# EAGLE design Buck_Regulator_AP3429A_1V8 (EAGLE 9.6.2)
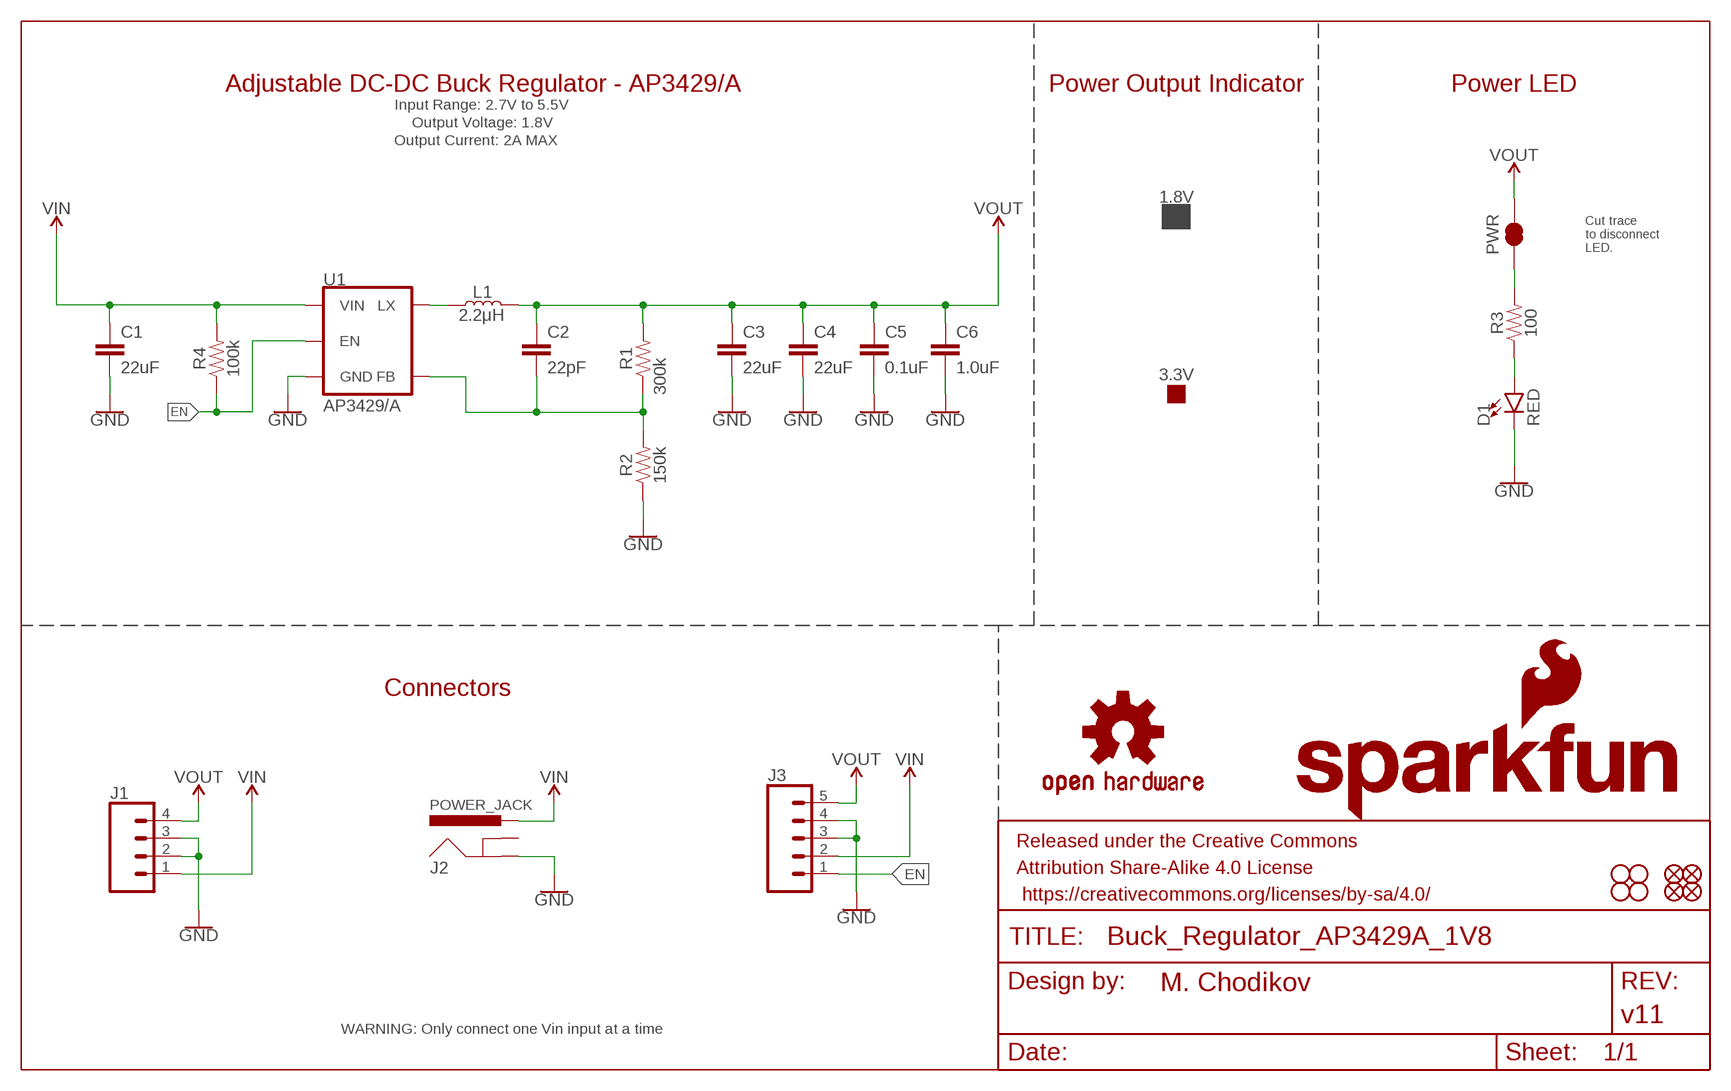
[diagram p0: schematic, sheet 1]

## Parts
1.8V  PROD_ID_PASTE_NO-SILK  [PRODUCT_IDENT_PASTE_NO-SILK]
3.3V  PROD_ID_NO-PASTE_NO_SILK  [PRODUCT_IDENT_NO_NO-SILK]
C1  22uF  22UF-0805-16V-20%  [0805]
C2  22pF  22PF-0402T-16V-10%  [0402-TIGHT]
C3  22uF  22UF-0805-16V-20%  [0805]
C4  22uF  22UF-0805-16V-20%  [0805]
C5  0.1uF  0.1UF-0603-25V-5%  [0603]
C6  1.0uF  1.0UF-0603-16V-10%-X7R  [0603]
D1  RED  LED-RED0603  [LED-0603]
FD1  FIDUCIALUFIDUCIAL  [FIDUCIAL-MICRO]
FD2  FIDUCIALUFIDUCIAL  [FIDUCIAL-MICRO]
FD3  FIDUCIALUFIDUCIAL  [FIDUCIAL-MICRO]
FD4  FIDUCIALUFIDUCIAL  [FIDUCIAL-MICRO]
FRAME1  FRAME-LEDGER  [CREATIVE_COMMONS]
H1  STAND-OFFTIGHT  [STAND-OFF-TIGHT]
H2  STAND-OFFTIGHT  [STAND-OFF-TIGHT]
H3  STAND-OFFTIGHT  [STAND-OFF-TIGHT]
H4  STAND-OFFTIGHT  [STAND-OFF-TIGHT]
J1  Screw Terminal  CONN_04SCREW  [SCREWTERMINAL-3.5MM-4]
J2  POWER_JACKPOWER_JACK_SLOT_COMBO  [POWER_JACK_PTH_SLOT_BOTH]
J3  Breakout Headers  CONN_05NO_SILK  [1X05_NO_SILK]
L1  2.2μH  2.2μH-4X4-2.2μH-3A-45MOHM  [INDUCTOR_4X4MM]
LOGO1  OSHW-LOGOS  [OSHW-LOGO-S]
LOGO2  SFE_LOGO_NAME.1_INCH  [SFE_LOGO_NAME_.1]
LOGO3  SFE_LOGO_FLAME.1_INCH  [SFE_LOGO_FLAME_.1]
PWR  JUMPER-SMT_2_NC_TRACE_SILK  [SMT-JUMPER_2_NC_TRACE_SILK]
R1  300k  300KOHM-0603-1/10W-1%  [0603]
R2  150k  150KOHM-0603-1/10W-1%  [0603]
R3  100  100OHM-0603-1/10W-1%  [0603]
R4  100k  100KOHM-0603-1/10W-1%  [0603]
U1  AP3429/A  [SOT23-5]

## Nets
EN: J3.1 R4.1 U1.1(EN)
GND: C1.2 C3.2 C4.2 C5.2 C6.2 D1.C J1.2 J1.3 J2.GND J3.3 J3.4 R2.1 U1.2(GND)
N$1: L1.P$1 U1.3(LX)
N$2: C2.2 R1.1 R2.2 U1.5(FB)
N$3: PWR.1 R3.2
N$4: D1.A R3.1
VIN: C1.1 J1.1 J2.PWR J3.2 R4.2 U1.4(VIN)
VOUT: C2.1 C3.1 C4.1 C5.1 C6.1 J1.4 J3.5 L1.P$2 PWR.2 R1.2
Unconnected: J2.GNDBREAK J2.GNDBREAK1(GNDBREAK)

## Notes on the sheet
- Adjustable DC-DC Buck Regulator - AP3429/A | Power Output Indicator | Power LED
- Input Range: 2.7V to 5.5V
- Output Voltage: 1.8V
- Output Current: 2A MAX
- Cut trace
  to disconnect
  LED.
- Connectors
- POWER_JACK
- WARNING: Only connect one Vin input at a time

## Library data of the parts
1.8V = SparkFun-Aesthetics:PROD_ID_PASTE
3.3V = SparkFun-Aesthetics:PROD_ID_NO-PASTE
C1 C3 C4 = SparkFun-Capacitors:22UF: 22µF ceramic capacitors A capacitor is a passive two-terminal electrical component used to store electrical energy temporarily in an electric field.; PROD_ID: CAP-14260
C2 = SparkFun-Capacitors:22PF: 22pF ceramic capacitors A capacitor is a passive two-terminal electrical component used to store electrical energy temporarily in an electric field.; PROD_ID: CAP-14674
C5 = SparkFun-Capacitors:0.1UF: 0.1µF ceramic capacitors A capacitor is a passive two-terminal electrical component used to store electrical energy temporarily in an electric field.; PROD_ID: CAP-08604
C6 = SparkFun-Capacitors:1.0UF: 1µF ceramic capacitors A capacitor is a passive two-terminal electrical component used to store electrical energy temporarily in an electric field.; PROD_ID: CAP-13930
D1 = SparkFun-LED:LED-RED: Red SMD LED Used in manufacturing of most products at SparkFun Packages: 0603 - SMD 0603 package [Product Link] <http://docs.avagotech.com/docs/AV02-0551EN> 0603 SMART - SMD 0603 SMART package ( more efficient and expensive)[Product Link] <http://www.osram-os.com/Graphics/XPic2/00077099_0.pdf> 1206 - SMD1206 package [Product Link] <https://www.sparkfun.com/datasheets/DevTools/LilyPad/Q150OVS4.pdff> SparkFun Products: Pro Mini 328 -5V <https://www.sparkfun.com/products/821> RedBoard <https://www.sparkfun.com/products/12757> IOIO-OTG <https://www.sparkfun.com/products/13613>; PROD_ID: DIO-00819
FD1-FD4 = SparkFun-Aesthetics:FIDUCIAL: Fiducial Alignment Points Point-of-reference for pick-and-place machines and other optical instruments.
FRAME1 = SparkFun-Aesthetics:FRAME-LEDGER: Schematic Frame - Ledger Standard 11x14 US Ledger frame; DESIGNER: M. Chodikov; REV: v11
H1-H4 = SparkFun-Hardware:STAND-OFF: Stand Off Drill holes for mechanically mounting via screws, standoffs, etc. Note: Use the keepout ring to avoid running the screw head into surrounding components. Variant Overviews STAND-OFF - Mechanical footprint for a #4 phillips button head screw. STAND-OFF-TIGHT - Mechanical footprint for a #4 phillips button head screw, Example SparkFun Products Screw - Phillips Head (1/4", 4-40, 10 pack) <https://www.sparkfun.com/products/10453> (PRT-10453) Screw - Phillips Head (1/2", 4-40, 10 pack) <https://www.sparkfun.com/products/10452> (PRT-10452) Screw - Phillips Head (3/4", 4-40, 10 pack) <https://www.sparkfun.com/products/10451> (PRT-10451) Screw - Phillips Head (1", 4-40, 10 pack) <https://www.sparkfun.com/products/10450> (PRT-10450)
J1 = SparkFun-Connectors:CONN_04: Multi connection point. Often used as Generic Header-pin footprint for 0.1 inch spaced/style header connections On any of the 0.1 inch spaced packages, you can populate with these: Break Away Headers - Straight <https://www.sparkfun.com/products/116> (PRT-00116) Break Away Male Headers - Right Angle <https://www.sparkfun.com/products/553> (PRT-00553) Female Headers <https://www.sparkfun.com/products/115> (PRT-00115) Break Away Headers - Machine Pin <https://www.sparkfun.com/products/117> (PRT-00117) Break Away Female Headers - Swiss Machine Pin <https://www.sparkfun.com/products/743> (PRT-00743) For SCREWTERMINALS and SPRING TERMINALS visit here: Screw Terimnals on SparkFun.com <https://www.sparkfun.com/search/results?term=Screw+Terminals> (5mm/3.5mm/2.54mm spacing) This device is also useful as a general connection point to wire up your design to another part of your project. Our various solder wires solder well into these plated through hole pads. Hook-Up Wire - Assortment (Stranded, 22 AWG) <https://www.sparkfun.com/products/11375> (PRT-11375) Hook-Up Wire - Assortment (Solid Core, 22 AWG) <https://www.sparkfun.com/products/11367> (PRT-11367) View the entire wire category on our website here <https://www.sparkfun.com/categories/141> Special notes: Molex polarized connector foot print use with SKU : PRT-08231 with associated crimp pins and housings. 1MM SMD Version SKU: PRT-10208; PROD_ID: CONN-14485
J2 = SparkFun-Connectors:POWER_JACK: Power Jack Connector This is the standard 5.5mm barrel jack for power. The PTH is the most common, proven, reliable, footprint. The Slot footprint only works if the mill layer is transmitted to the PCB fab house so be warned. Here are the connectors we sell at SparkFun: DC Barrel Power Jack/Connector <https://www.sparkfun.com/products/119> (PRT-00119) DC Barrel Power Jack/Connector (SMD) <https://www.sparkfun.com/products/12748> (PRT-12748) DC Barrel Jack Adapter - Breadboard Compatible <https://www.sparkfun.com/products/10811> (PRT-10811) It is used on this SparkFun product (and many, many others): SparkFun RedBoard - Programmed with Arduino <https://www.sparkfun.com/products/12757> (DEV-12757) Also, if you need a mating power supply or connector, please check these out: Wall Adapter Power Supply - 9VDC 650mA <https://www.sparkfun.com/products/298> (TOL-00298) DC Barrel Jack Adapter - Male <https://www.sparkfun.com/products/10287> (PRT-10287)
J3 = SparkFun-Connectors:CONN_05: Multi connection point. Often used as Generic Header-pin footprint for 0.1 inch spaced/style header connections On any of the 0.1 inch spaced packages, you can populate with these: Break Away Headers - Straight <https://www.sparkfun.com/products/116> (PRT-00116) Break Away Male Headers - Right Angle <https://www.sparkfun.com/products/553> (PRT-00553) Female Headers <https://www.sparkfun.com/products/115> (PRT-00115) Break Away Headers - Machine Pin <https://www.sparkfun.com/products/117> (PRT-00117) Break Away Female Headers - Swiss Machine Pin <https://www.sparkfun.com/products/743> (PRT-00743) For SCREWTERMINALS and SPRING TERMINALS visit here: Screw Terimnals on SparkFun.com <https://www.sparkfun.com/search/results?term=Screw+Terminals> (5mm/3.5mm/2.54mm spacing) This device is also useful as a general connection point to wire up your design to another part of your project. Our various solder wires solder well into these plated through hole pads. Hook-Up Wire - Assortment (Stranded, 22 AWG) <https://www.sparkfun.com/products/11375> (PRT-11375) Hook-Up Wire - Assortment (Solid Core, 22 AWG) <https://www.sparkfun.com/products/11367> (PRT-11367) View the entire wire category on our website here <https://www.sparkfun.com/categories/141> Special notes: Molex polarized connector foot print use with SKU : PRT-08231 with associated crimp pins and housings. 1MM SMD Version SKU: PRT-10208
L1 = SparkFun-Coils:2.2μH: 2.2μH Inductor Resist changes in electrical current. Basically a coil of wire. SparkFun Products: SparkFun Edge - HX711 <https://www.sparkfun.com/products/15170>; PROD_ID: NDUC-13770
LOGO1 = SparkFun-Aesthetics:OSHW-LOGO: Open-Source Hardware (OSHW) Logo This logo indicates the piece of hardware it is found on incorporates a OSHW license and/or adheres to the definition of open source hardware found here: http://freedomdefined.org/OSHW
LOGO2 = SparkFun-Aesthetics:SFE_LOGO_NAME: SparkFun Font Logo This is the SparkFun name logo. The logo on the schematic will always be the same size; the package variant is the height of the flame part of the logo (or the height the flame would be, if it were drawn). Default layer for the logo on the board is tSilk.
LOGO3 = SparkFun-Aesthetics:SFE_LOGO_FLAME: SparkFun Flame Logo This is the SparkFun flame logo. The logo on the schematic will always be the same size; the package variant is the height of the flame. Default layer for the logo on the board is tSilk.
PWR = SparkFun-Jumpers:JUMPER-SMT_2_NC_TRACE: Normally closed trace jumper This jumper has a trace between two pads so it's normally closed (NC). Use a razor knife to open the connection. For best results follow the IPC guidelines for cutting traces: Cutout at least 0.063 mm (0.005 in). Remove all loose material to clean up the cut area. Seal the cut with an approved epoxy. Reapply solder to reclose the connection.
R1 = SparkFun-Resistors:300KOHM: 300kΩ resistor A resistor is a passive two-terminal electrical component that implements electrical resistance as a circuit element. Resistors act to reduce current flow, and, at the same time, act to lower voltage levels within circuits. - Wikipedia; PROD_ID: RES-10809
R2 = SparkFun-Resistors:150KOHM: 150kΩ resistor A resistor is a passive two-terminal electrical component that implements electrical resistance as a circuit element. Resistors act to reduce current flow, and, at the same time, act to lower voltage levels within circuits. - Wikipedia; PROD_ID: RES-09117
R3 = SparkFun-Resistors:100OHM: 100Ω resistor A resistor is a passive two-terminal electrical component that implements electrical resistance as a circuit element. Resistors act to reduce current flow, and, at the same time, act to lower voltage levels within circuits. - Wikipedia; PROD_ID: RES-07863
R4 = SparkFun-Resistors:100KOHM: 100kΩ resistor A resistor is a passive two-terminal electrical component that implements electrical resistance as a circuit element. Resistors act to reduce current flow, and, at the same time, act to lower voltage levels within circuits. - Wikipedia; PROD_ID: RES-07828
U1 = SparkFun-IC-Power:AP3429/A: AP3429A DC adjustable buck up to 2A output. Auto cut-off at 2.7V makes this a good option for LiPo and other battery powered circuits.; PROD_ID: IC-14465

## Board
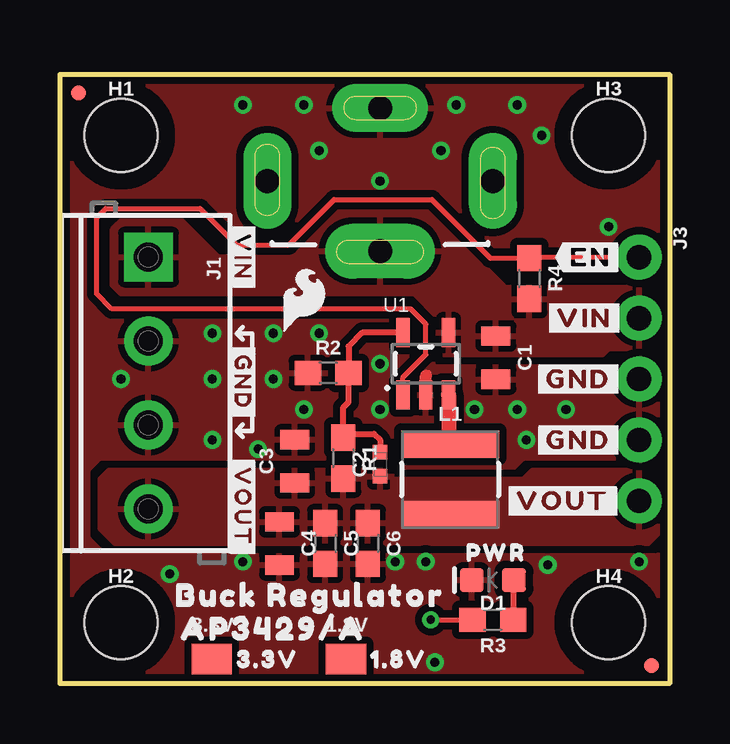
[diagram p1: board, top side]
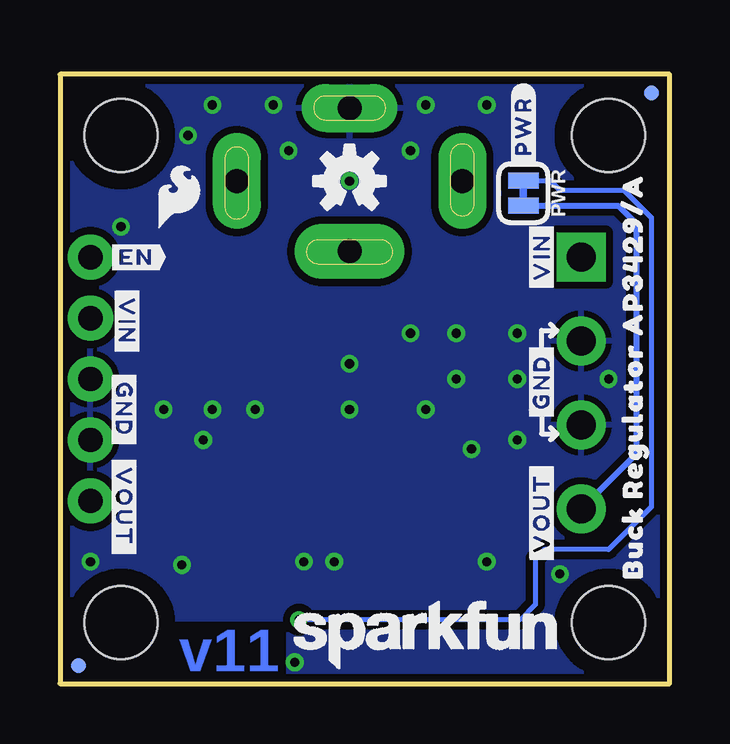
[diagram p2: board, bottom side, seen from below]

Size 25.4 x 25.4 mm. Coordinates in mm from the lower left corner, seen from the top.
Outline: 0,0 0,25.4 25.4,25.4 25.4,0 0,0
Copper layers (1*16): Top 0.035mm / dielectric 1.5mm / Bottom 0.035mm
Design rules "SparkFun-2-Layer-General-JLCPCB": minimum track width 7mil, minimum drill 0.3mm, track to track 7mil, track to pad 7mil, pad to pad 7mil, via to via 7mil, smd to smd 7mil, copper to edge 7mil, drill to drill 7mil, minimum pad ring 7mil, minimum via ring 7mil, stop-mask expansion 3mil, vias tented up to drill 25mil, thermal gap 10mil

### Footprints (pad centres in the part's own frame; a part is rotated, then mirrored left to right if it is on the bottom)
PRODUCT_IDENT_PASTE_NO-SILK = smd 1.676 x 1.27: 1 -0.025,0
PRODUCT_IDENT_NO_NO-SILK = smd 1.676 x 1.27: 1 -0.025,0
0805 = smd 0.8 x 1.2: 1 -0.9,0; 2 0.9,0
0402-TIGHT = smd 0.6 x 0.6: 1 -0.5,0; 2 0.5,0
0603 = smd 1.1 x 1: 1 -0.85,0; 2 0.85,0
LED-0603 = smd 1 x 1: A -0.877,0; C 0.877,0
FIDUCIAL-MICRO = smd 0.635 x 0.635: 1 0,0
STAND-OFF-TIGHT = hole 3.048: 0,0
SCREWTERMINAL-3.5MM-4 = drill 1.2 pad 2.032 square: 1 0,0 | drill 1.2 pad 2.032: 2 3.5,0; 3 7,0; 4 10.5,0
POWER_JACK_PTH_SLOT_BOTH = drill 1 pad 2 long: GND 0,0; GNDBREAK -3.048,4.699; GNDBREAK1 -3.048,-4.699 | drill 1 pad 2.3 long: PWR -5.969,0
1X05_NO_SILK = drill 1.016 pad 1.88: 1 0,0; 2 2.54,0; 3 5.08,0; 4 7.62,0; 5 10.16,0
INDUCTOR_4X4MM = smd 4.089 x 1.143: P$1 0,1.473; P$2 0,-1.473
SMT-JUMPER_2_NC_TRACE_SILK = smd 0.66 x 1.27: 1 -0.521,0; 2 0.521,0
SOT23-5 = smd 0.55 x 1.2: 1 -0.95,-1.3; 2 0,-1.3; 3 0.95,-1.3; 4 0.95,1.3; 5 -0.95,1.3

### Placement (x,y rotation side)
1.8V  11.94,1.02 0 top
3.3V  6.35,1.02 0 top
C1  18.16,13.59 270 top
C2  13.34,9.14 90 top
C3  9.78,9.27 90 top
C4  9.14,5.84 270 top
C5  11.05,5.84 270 top
C6  12.83,5.84 270 top
D1  18.03,4.32 180 top
FD1  24.64,0.76 0 bottom
FD2  24.64,0.76 0 top
FD3  0.76,24.64 0 bottom
FD4  0.76,24.64 0 top
FRAME1  -10.16,-44.45 0 top  (outside the outline)
H1  2.54,22.86 0 top
H2  2.54,2.54 0 top
H3  22.86,22.86 0 top
H4  22.86,2.54 0 top
J1  3.68,17.78 270 top
J2  13.34,24 90 top
J3  24.13,17.78 270 top
L1  16.26,8.51 0 top
LOGO1  13.34,20.95 0 bottom
LOGO2  10.16,2.03 0 bottom
LOGO3  20.45,20.32 0 bottom
PWR  6.1,20.45 270 bottom
R1  11.81,9.4 270 top
R2  11.18,12.95 0 top
R3  18.03,2.67 180 top
R4  19.56,16.89 270 top
U1  15.24,13.34 0 top
U$1  [SFE_LOGO_FLAME_.1]  10.16,16 0 top
U$2  [BUCK_REGULATOR24]  10.41,3.68 0 top
U$3  [AP3429#A25]  8.89,2.29 0 top
U$4  [#VOUT#3431]  20.95,7.62 0 top
U$5  [#GND#3432]  21.59,10.16 0 top
U$6  [#GND#3432]  21.59,12.7 0 top
U$7  [#VIN#3433]  21.84,15.24 0 top
U$8  [#GND#3446]  5.33,12.57 90 bottom
U$9  [#VIN#3445]  22.61,15.11 270 bottom
U$10  [#GND#3446]  22.73,11.43 270 bottom
U$11  [#VOUT#3447]  22.73,7.37 270 bottom
U$12  [#EN#3448]  22.23,17.78 0 bottom
U$13  [#VOUT#3447]  5.33,7.11 90 bottom
U$14  [#PWR#3451]  6.1,23.24 90 bottom
U$15  [#VIN#3445]  5.33,17.78 90 bottom
U$16  [BUCK_REGULATOR_AP3429#A3453]  1.52,12.83 90 bottom
U$17  [ORDERING_INSTRUCTIONS]  31.75,25.4 0 top  (outside the outline)
U$19  [1#8V3441]  14.1,1.02 0 top
U$20  [PWR3441]  18.16,5.46 0 top
U$21  [#VOUT#3437]  7.62,7.37 270 top
U$22  [#VIN#3438]  7.62,17.78 270 top
U$23  [3#3V3441]  8.64,1.02 0 top
U$24  [#GND#3439]  7.62,12.57 270 top
U$25  [#EN#3443]  22.1,17.78 0 top

### Tracks (layer width: path | path; a pad name or v marks a point on that pad's centre or on a via)
EN
  Top 0.203: U1.1 14.29,12.77 15.24,13.72 15.24,14.99 14.61,15.62 2.16,15.62 1.52,16.26 1.52,19.43 1.91,19.81 5.84,19.81 7.37,18.29 9.53,18.29 11.42,20.18 15.49,20.18 17.93,17.74 R4.1 19.6,17.78 J3.1
GND  (via drill 0.38)
  Top 0.203: 15.24,12.83 15.37,12.95
  Top 0.508: U1.2 15.24,12.83
  other vias: 19.43,10.16 24.13,5.08 13.34,20.95 21.08,11.43 20.32,4.95 19.05,11.43 13.34,11.43 13.34,13.34 10.79,14.61 8.89,14.61 8.89,12.7 10.16,11.43 17.27,11.43 8.26,9.78 19.05,24.13 7.62,24.13 6.35,14.61 6.35,10.16 15.24,5.08 7.62,5.08 22.86,19.05 20.07,22.86 6.35,12.7 2.54,12.7 15.62,0.89 15.88,22.23 10.79,22.23 16.51,24.13 10.16,24.13 13.97,5.08 4.57,4.57
  pour Top (isolate 0.305, rank 2): 0,0 0,25.4 25.4,25.4 25.4,0
  pour Bottom (isolate 0.305): 0,0 0,25.4 25.4,25.4 25.4,0
N$1
  Top 0.406: 16.19,10.05 L1.P$1
  Top 0.635: U1.3 16.19,10.05
N$2
  Top 0.178: R1.1 11.86,10.25 | 11.86,10.25
  Top 0.203: 11.86,10.25 12.03,10.41
  Top 0.254: U1.5 12.6,14.63 12.03,14.06 R2.2 12.03,11.73 11.81,11.52 R1.1 | 12.03,10.41 13.08,10.41 13.34,10.16 C2.2
N$3  (via drill 0.35)
  Top 0.203: v15.45,2.67 R3.2
  Bottom 0.203: PWR.1 4.97,20.97 4.57,20.57 1.91,20.57 0.76,19.43 0.76,7.37 2.54,5.59 5.21,5.59 5.59,5.21 5.59,3.3 6.22,2.67 v15.45,2.67
N$4
  Top 0.254: D1.A 18.88,4.29 R3.1
VIN
  pour Top (isolate 0.305): 2.16,18.92 2.16,16.64 2.54,16.26 14.73,16.26 15.75,15.24 15.75,13.97 16,13.72 22.61,13.72 22.86,13.97 24.89,13.97 25.4,14.48 25.4,15.88 24.77,16.51 18.54,16.51 15.24,19.81 11.56,19.81 9.53,17.78 6.6,17.78 4.95,19.43 2.67,19.43
VOUT
  Bottom 0.254: PWR.2 2.15,19.93 1.4,19.18 1.4,9.57 J1.4
  pour Top (isolate 0.305): 1.65,8.51 1.65,6.48 2.29,5.84 13.84,5.84 13.84,8.89 2.03,8.89
  pour Top (isolate 0.305, no thermals): 13.84,5.84 19.3,5.84 19.3,8.51 13.84,8.51
  pour Top (isolate 0.305): 19.3,5.84 24.51,5.84 25.4,6.73 25.4,8.51 25.02,8.89 19.68,8.89 19.3,8.51

### Text on the board
Bottom: v11
Measures: Units in Inches
tDocu: Board thickness is 1.6mm / 2-Layer / 1oz copper | M. Chodikov